# Altium schematic sheet Connector.SchDoc
size A4; SheetNumber: 6; SheetTotal: 6
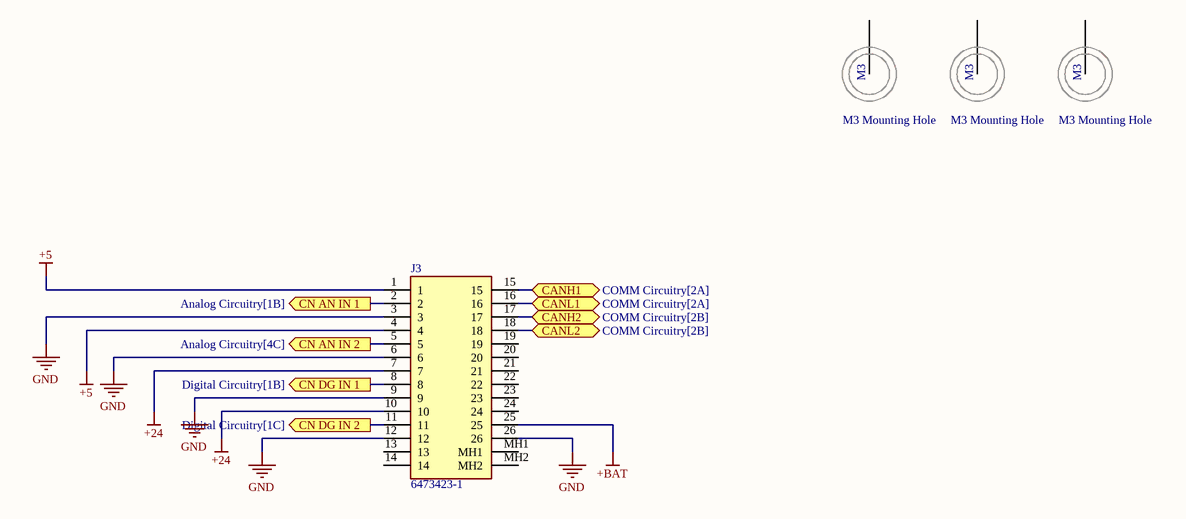
[diagram p0: Connector.SchDoc]

## Parts
(Parts that share a designator on the sheet are numbered #1, #2 ... from top to bottom, then left to right.)
?#1  M3 Mounting Hole  [M3 - Mounting Hole]
?#2  M3 Mounting Hole  [M3 - Mounting Hole]
?#3  M3 Mounting Hole  [M3 - Mounting Hole]
J3  6473423-1  [64734231]

## Ports
CANH1 (bidir, see COMM Circuitry[2A]), CANH2 (bidir, see COMM Circuitry[2B]), CANL1 (bidir, see COMM Circuitry[2A]), CANL2 (bidir, see COMM Circuitry[2B]), CN AN IN 1 (out, see Analog Circuitry[1B]), CN AN IN 2 (out, see Analog Circuitry[4C]), CN DG IN 1 (out, see Digital Circuitry[1B]), CN DG IN 2 (out, see Digital Circuitry[1C])

## Nets
+5: J3.1 J3.4
+24: J3.7 J3.10
+BAT: J3.25
GND: J3.3 J3.6 J3.9 J3.12 J3.26
CANH1: J3.15 ; port CANH1
CANH2: J3.17 ; port CANH2
CANL1: J3.16 ; port CANL1
CANL2: J3.18 ; port CANL2
CN AN IN 1: J3.2 ; port CN AN IN 1
CN AN IN 2: J3.5 ; port CN AN IN 2
CN DG IN 1: J3.8 ; port CN DG IN 1
CN DG IN 2: J3.11 ; port CN DG IN 2

Not connected (* = marked no-connect by the designer): ?#1 1(M3); ?#2 1(M3); ?#3 1(M3); J3 13 14 19 20 21 22 23 24 MH1 MH2

## Library data of the parts
J3 = 6473423-1: Connector; Manufacturer_Name: TE Connectivity; Datasheet Link: https://www.te.com/commerce/DocumentDelivery/DDEController?Action=showdoc&DocId=Customer+Drawing%7F9-1437287-8%7FA1%7Fpdf%7FEnglish%7FENG_CD_9-1437287-8_A1.pdf%7F6473423-1; Height: 27.9mm; Manufacturer_Part_Number: 6473423-1; Mouser Part Number: 571-6473423-1; Mouser Price/Stock: https://www.mouser.co.uk/ProductDetail/TE-Connectivity/6473423-1?qs=XhI5AayaxxW9FyxB9N39mQ%3D%3D